# EAGLE schematic sonar_direction (EAGLE 7.1.1)
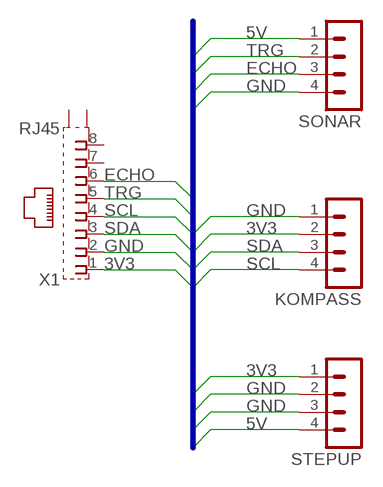
[diagram p0: schematic, sheet 1]

## Parts
KOMPASS  MA04-1  [MA04-1]
SONAR  MA04-1  [MA04-1]
STEPUP  MA04-1  [MA04-1]
X1  RJ45  GLX-S-88M  [GLX-S-88M]

## Nets
3V3: KOMPASS.2 STEPUP.1 X1.1
5V: SONAR.1 STEPUP.4
ECHO: SONAR.3 X1.6
GND: KOMPASS.1 SONAR.4 STEPUP.2 STEPUP.3 X1.2
SCL: KOMPASS.4 X1.4
SDA: KOMPASS.3 X1.3
TRG: SONAR.2 X1.5
Unconnected: X1.7 X1.8 X1.S1 X1.S2

## Buses
B$1

## Library data of the parts
KOMPASS SONAR STEPUP = con-lstb:MA04-1: PIN HEADER; OC_FARNELL: unknown; OC_NEWARK: unknown
X1 = con-kycon:GLX-S-88M: Mod. Jack, Right Angle, 8 posiotion, 8 contatcs RJ45 Source: GLX-S-88M.pdf; OC_FARNELL: unknown; OC_NEWARK: unknown